# Altium schematic sheet 5_SWD.schdoc.schdoc
size 309 x 223 mm; Symbol: Sheet-Symbol_A4; Device: Sheet-Symbol_A4; @Page Name: SWD; @Create Date: 2023-12-01; @Page Count: 7; @Page No: 7; @Project Name: STM32F722RET6; @Schematic Name: 开发板; @Update Date: 2023-12-01; Company: 嘉立创EDA; Page Size: A4; Version: V1.0
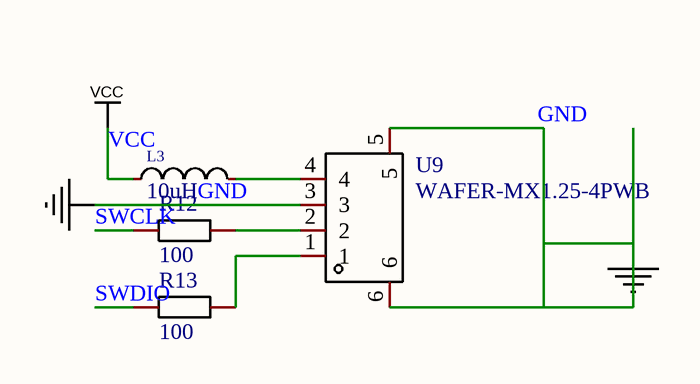
[diagram p0: 5_SWD.schdoc.schdoc]

## Parts
L3  10uH  [L0603]
R12  100  [R0603]
R13  100  [R0603]
U9  WAFER-MX1.25-4PWB  [CONN-SMD_4P-P1.25_WAFER-MX1.25-4PWB]

## Nets
GND: U9.3 U9.5 U9.6
VCC: L3.1
SWCLK: R12.1
SWDIO: R13.1
NetL3_2: L3.2 U9.4
NetR12_2: R12.2 U9.2
NetR13_2: R13.2 U9.1

## Notes on the sheet
- 1
- 2
- 3
- 4
- 5
- 6
- A
- B
- C
- 原理图
- 开发板
- 创建日期
- 更新日期
- 2023-12-01
- 审阅
- 绘制
- 图页
- SWD
- 物料编码
- STM32F722RET6
- D
- 版本
- 尺寸
- 页
- 7
- 共
- V1.0
- A4
- 嘉立创EDA

## Library data of the parts
L3 = L_0603: Manufacturer: Sunlord(顺络); Symbol: SDFL1608S100KTF; Add into BOM: yes; Name: 10uH; Device: L_0603; Supplier Footprint: L0603; Convert to PCB: yes; Value: 10uH; Supplier: LCSC; Manufacturer Part: SDFL1608S100KTF; Supplier Part: C1035; JLCPCB Part Class: Basic Part
R12 R13 = Res_0603: Symbol: 电阻; Convert to PCB: yes; Name: 100; Device: Res_0603; Add into BOM: yes; Supplier Footprint: 0603; Value: 100
U9 = WAFER-MX1.25-4PWB: 插针结构:1x4P;间距:1.25mm;公母:公;安装方式:卧贴;排数:1;每排PIN数:4;额定电流:1A;工作温度范围:-25℃~+85℃;; Manufacturer: XUNPU(讯普); Add into BOM: yes; Pins Structure: 1x4P; Pitch: 1.25mm; Gender: 公; Number of PINs Per Row: 4; Current Rating (Max): 1A; Name: WAFER-MX1.25-4PWB; Symbol: WAFER-MX1.25-4PWB; Device: WAFER-MX1.25-4PWB; LCSC Part Name: 1x4P 间距:1.25mm 卧贴; Supplier Part: C3029361; Manufacturer Part: WAFER-MX1.25-4PWB; Supplier Footprint: SMD,P=1.25mm; JLCPCB Part Class: Extended Part; Datasheet: https://atta.szlcsc.com/upload/public/pdf/source/20220527/5ACBB683E384B6AD06743F272F933620.pdf; Supplier: LCSC; Convert to PCB: yes; Mounting Style: 卧贴; Number of Rows: 1; Operating Temperature Range: -25℃~+85℃